# EAGLE design DectectorPhotodiode (EAGLE 5.11)
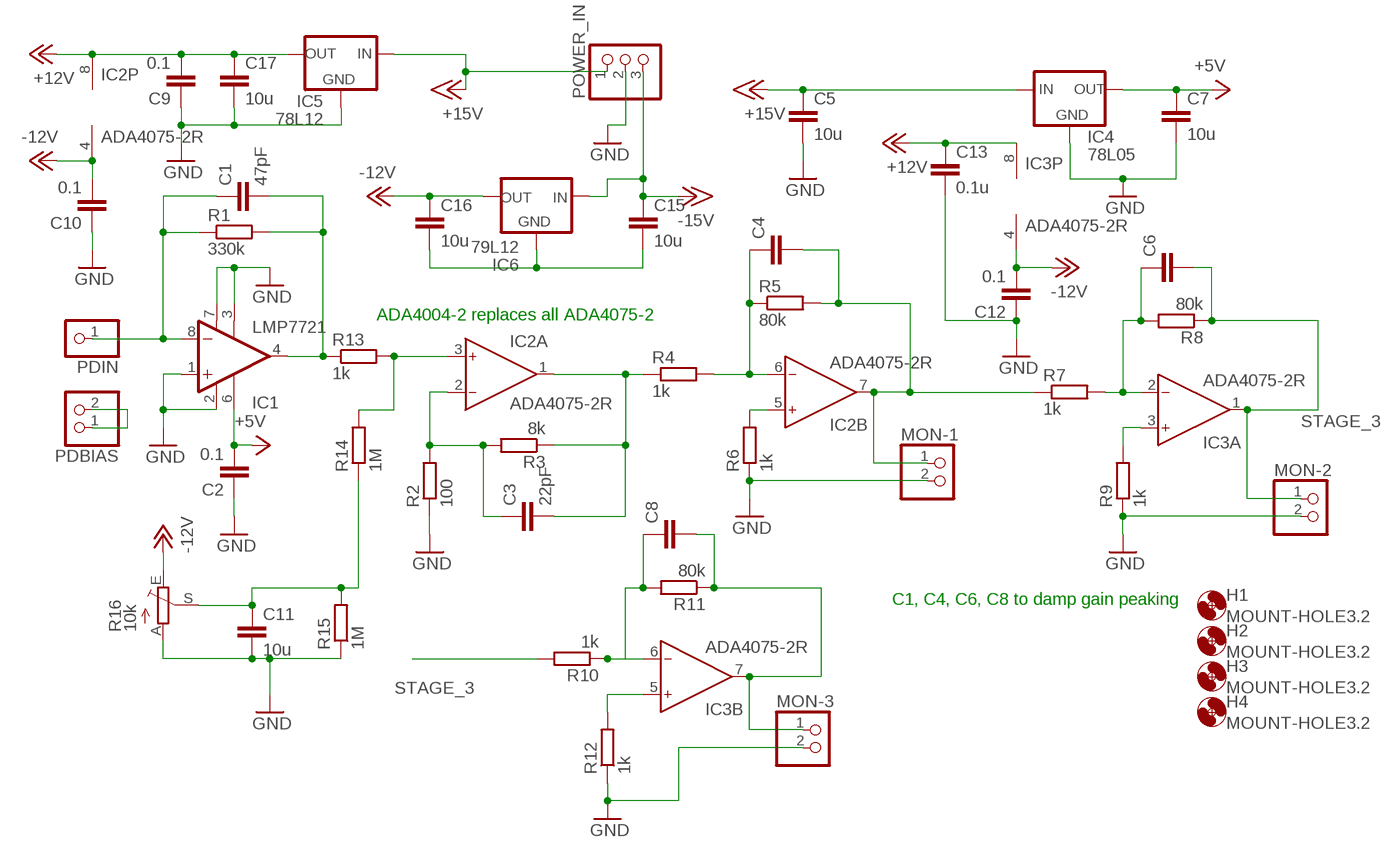
[diagram p0: schematic, sheet 1]

## Parts
C1  47pF  C-EUC0805  [C0805]
C2  0.1  C-EUC0805  [C0805]
C3  22pF  C-EUC0805  [C0805]
C4  C-EUC0805  [C0805]
C5  10u  C-EUC1206  [C1206]
C6  C-EUC0805  [C0805]
C7  10u  C-EUC1206  [C1206]
C8  C-EUC0805  [C0805]
C9  0.1  C-EUC0805  [C0805]
C10  0.1  C-EUC0805  [C0805]
C11  10u  C-EUC1206  [C1206]
C12  0.1  C-EUC0805  [C0805]
C13  0.1u  C-EUC0805  [C0805]
C15  10u  C-EUC1206  [C1206]
C16  10u  C-EUC1206  [C1206]
C17  10u  C-EUC1206  [C1206]
H1  MOUNT-HOLE3.2  [3,2]
H2  MOUNT-HOLE3.2  [3,2]
H3  MOUNT-HOLE3.2  [3,2]
H4  MOUNT-HOLE3.2  [3,2]
IC1  LMP7721  [SOIC8]
IC2  ADA4075-2R  [SO8]
IC3  ADA4075-2R  [SO8]
IC4  78L05  78LXX  [78LXX]
IC5  78L12  78LXX  [78LXX]
IC6  79L12  79LXX  [79LXX]
MON-1  PINHD-1X2  [1X02]
MON-2  PINHD-1X2  [1X02]
MON-3  PINHD-1X2  [1X02]
PDBIAS  PINHD-1X2  [1X02]
PDIN  PINHD-1X1  [1X01]
POWER_IN  PINHD-1X3  [1X03]
R1  330k  R-EU_R0805  [R0805]
R2  100  R-EU_R0805  [R0805]
R3  8k  R-EU_R0805  [R0805]
R4  1k  R-EU_R0805  [R0805]
R5  80k  R-EU_R0805  [R0805]
R6  1k  R-EU_R0805  [R0805]
R7  1k  R-EU_R0805  [R0805]
R8  80k  R-EU_R0805  [R0805]
R9  1k  R-EU_R0805  [R0805]
R10  1k  R-EU_R0805  [R0805]
R11  80k  R-EU_R0805  [R0805]
R12  1k  R-EU_R0805  [R0805]
R13  1k  R-EU_R0805  [R0805]
R14  1M  R-EU_R0805  [R0805]
R15  1M  R-EU_R0805  [R0805]
R16  10k  TRIM_EU-S63P  [S63P]

## Nets
+5V: C2.2 C7.1 IC1.6(V+) IC4.OUT
+12V: C9.2 C13.1 C17.1 IC2.8(P:V+) IC3.8(P:V+) IC5.OUT
+15V: C5.1 IC4.IN IC5.IN POWER_IN.1
-12V: C10.2 C12.2 C16.1 IC2.4(P:V-) IC3.4(P:V-) IC6.OUT R16.E
-15V: C15.1 IC6.IN POWER_IN.3
GND: C2.1 C5.2 C7.2 C9.1 C10.1 C11.2 C12.1 C13.2 C17.2 IC1.1(+IN) IC1.2(GRD) IC1.3(V-) IC1.7(GRD2) IC4.GND IC5.GND MON-1.2 MON-2.2 MON-3.2 POWER_IN.2 R2.1 R6.1 R9.1 R12.1 R15.1 R16.A
N$1: C1.1 IC1.8(-IN) PDIN.1 R1.1
N$2: C1.2 IC1.4(OUT) R1.2 R13.1
N$3: C3.1 IC2.2(A:IN-) R2.2 R3.2
N$4: C3.2 IC2.1(A:OUT) R3.1 R4.1
N$5: C4.1 IC2.6(B:IN-) R4.2 R5.1
N$6: IC2.5(B:IN+) R6.2
N$7: C4.2 IC2.7(B:OUT) MON-1.1 R5.2 R7.1
N$9: C6.1 IC3.2(A:IN-) R7.2 R8.2
N$10: C11.1 R14.1 R15.2 R16.S
N$11: PDBIAS.1 PDBIAS.2
N$12: IC3.3(A:IN+) R9.2
N$13: C8.1 IC3.6(B:IN-) R10.1 R11.2
N$14: C8.2 IC3.7(B:OUT) MON-3.1 R11.1
N$15: IC3.5(B:IN+) R12.2
N$16: IC2.3(A:IN+) R13.2 R14.2
N$22: C15.2 C16.2 IC6.GND
STAGE_3: C6.2 IC3.1(A:OUT) MON-2.1 R8.1 R10.2

## Notes on the sheet
- ADA4004-2 replaces all ADA4075-2
- C1, C4, C6, C8 to damp gain peaking

## Library data of the parts
C1-C13 C15-C17 = rcl:C-EU: CAPACITOR, European symbol
H1-H4 = holes:MOUNT-HOLE: MOUNTING HOLE with drill center marker
IC1 = custom_parts:LMP7721: 3fA input bias precision amplifier, National Semiconductor
IC2 IC3 = analog-devices:ADA4075-2: Ultralow Noise Amplifier at Lower Power Source: http://www.analog.com/static/imported-files/data_sheets/ADA4075-2.pdf; MPN: ADA4075-2ARZ; OC_FARNELL: 1701254; OC_NEWARK: 19P8164
IC4 IC5 = v-reg:78LXX: VOLTAGE REGULATOR
IC6 = v-reg:79LXX: VOLTAGE REGULATOR
MON-1-MON-3 PDBIAS = pinhead:PINHD-1X2: PIN HEADER
PDIN = pinhead:PINHD-1X1: PIN HEADER
POWER_IN = pinhead:PINHD-1X3: PIN HEADER
R1-R15 = rcl:R-EU_: RESISTOR, European symbol
R16 = pot:TRIM_EU-: POTENTIOMETER

## Board
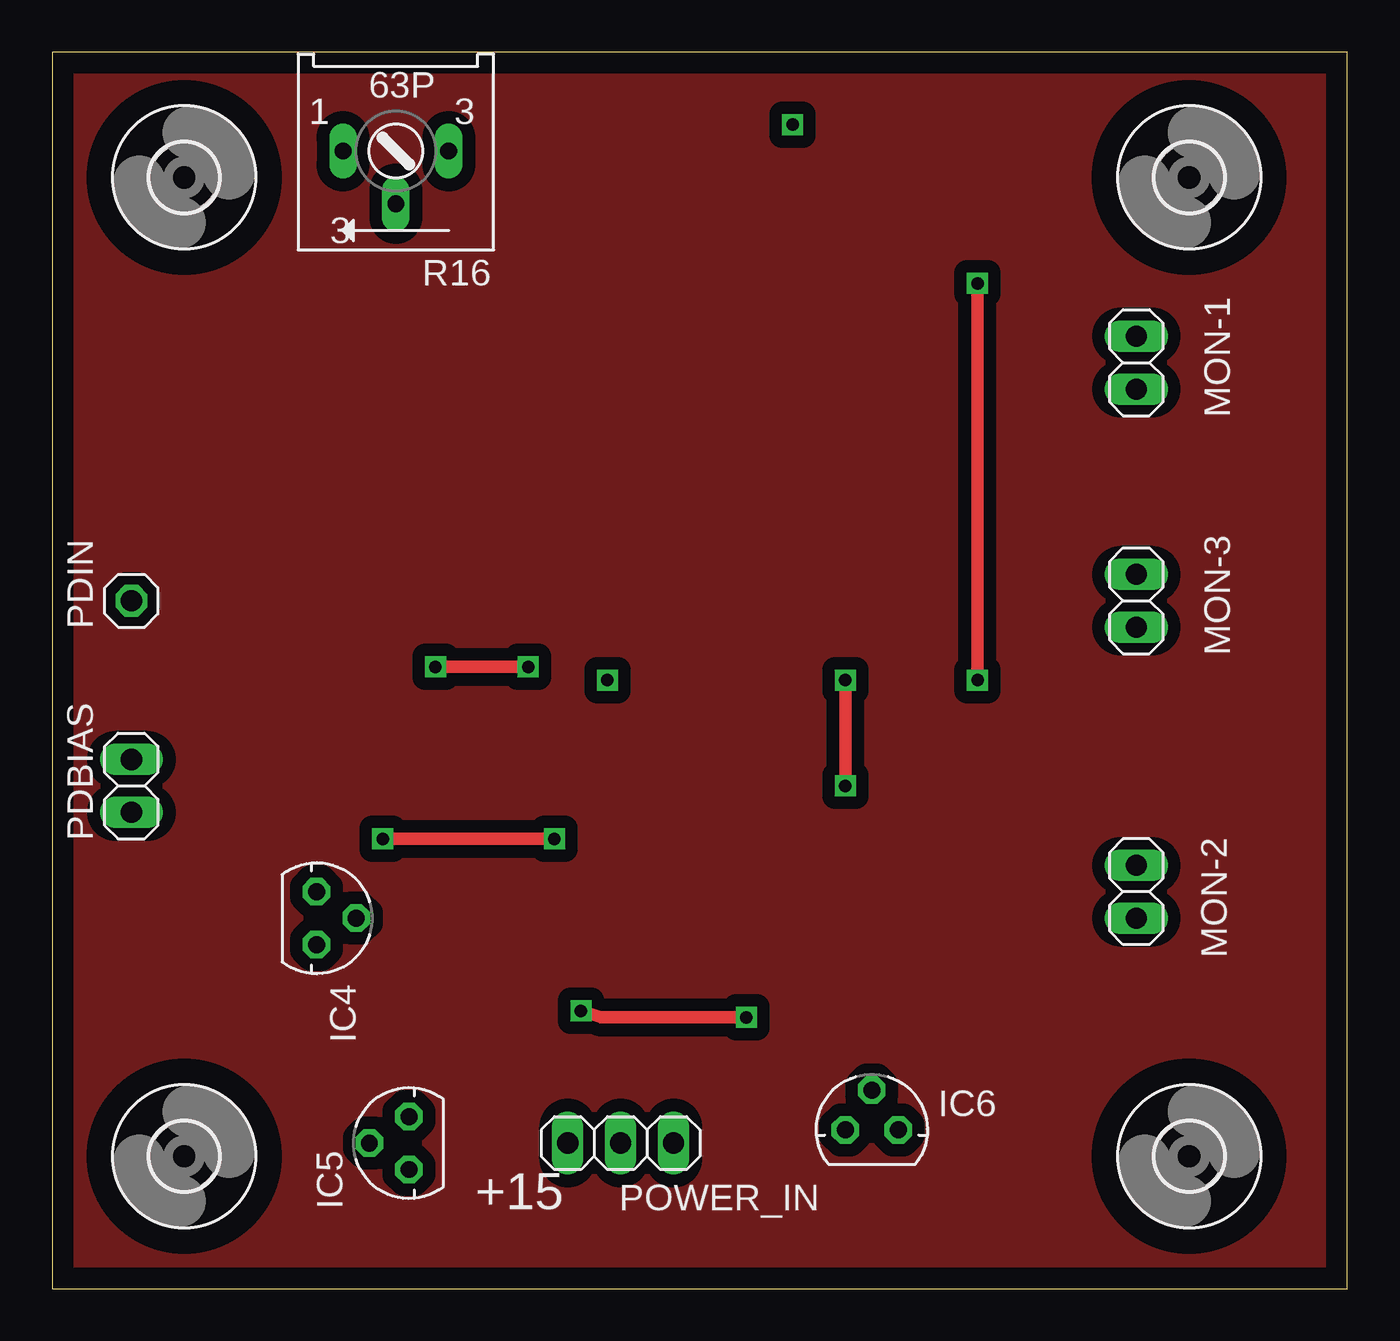
[diagram p1: board, top side]
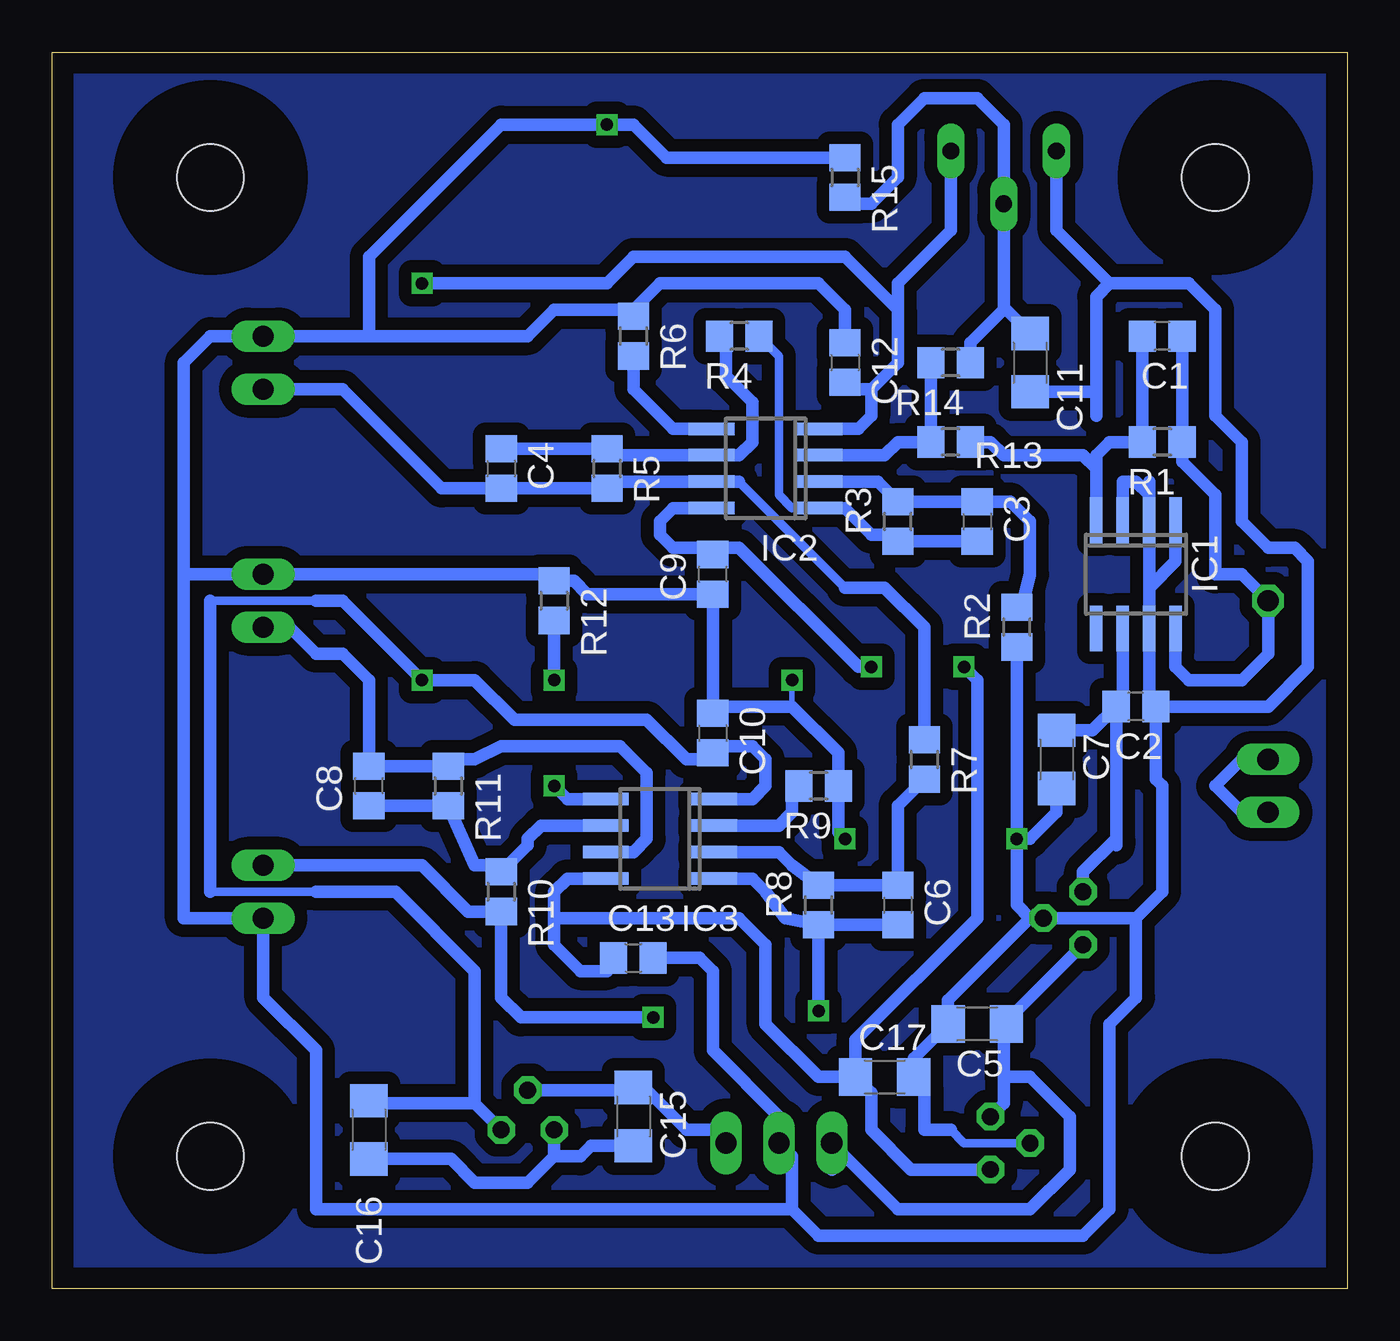
[diagram p2: board, bottom side, seen from below]

Size 62.21 x 59.36 mm. Coordinates in mm from the lower left corner, seen from the top.
Outline: 0,0 62.21,0 62.21,59.36 0,59.36 0,0
Copper layers (1*16): Top 0.035mm / dielectric 1.5mm / Bottom 0.035mm
Design rules "default": minimum track width 10mil, minimum drill 24mil, track to track 8mil, track to pad 8mil, pad to pad 8mil, via to via 8mil, smd to smd 8mil, copper to edge 40mil, drill to drill 8mil, minimum pad ring 10mil, minimum via ring 8mil, stop-mask expansion 4mil, vias tented up to drill 0mil, thermal gap 10mil

### Footprints (pad centres in the part's own frame; a part is rotated, then mirrored left to right if it is on the bottom)
C0805 = smd 1.3 x 1.5: 1 -0.95,0; 2 0.95,0
C1206 = smd 1.6 x 1.8: 1 -1.4,0; 2 1.4,0
3,2 = hole 3.2: 0,0
SOIC8 = smd 0.6 x 2.2: 1 -1.905,-2.6; 2 -0.635,-2.6; 3 0.635,-2.6; 4 1.905,-2.6; 5 1.905,2.6; 6 0.635,2.6; 7 -0.635,2.6; 8 -1.905,2.6
SO8 = smd 0.6 x 2.2: 1 -1.905,-2.6; 2 -0.635,-2.6; 3 0.635,-2.6; 4 1.905,-2.6; 5 1.905,2.6; 6 0.635,2.6; 7 -0.635,2.6; 8 -1.905,2.6
78LXX = drill 0.813 octagon: GND 0,1.905; IN 1.27,0; OUT -1.27,0
79LXX = drill 0.813 octagon: GND -1.27,0; IN 0,1.905; OUT 1.27,0
1X02 = drill 1.016 long: 1 -1.27,0; 2 1.27,0
1X01 = drill 1.016 octagon: 1 0,0
1X03 = drill 1.016 long: 1 -2.54,0; 2 0,0; 3 2.54,0
R0805 = smd 1.3 x 1.5: 1 -0.95,0; 2 0.95,0
S63P = drill 0.813 long: A 2.54,0; E -2.54,0; S 0,2.54

### Placement (x,y rotation side)
C1  8.89,45.72 180 bottom
C2  10.16,27.94 180 bottom
C3  17.78,36.83 270 bottom
C4  40.64,39.37 270 bottom
C5  17.78,12.7 180 bottom
C6  21.59,18.41 270 bottom
C7  13.97,25.4 270 bottom
C8  46.99,24.13 90 bottom
C9  30.48,34.29 90 bottom
C10  30.48,26.67 270 bottom
C11  15.24,44.45 270 bottom
C12  24.13,44.45 270 bottom
C13  34.29,15.88 0 bottom
C15  34.29,8.26 270 bottom
C16  46.99,7.62 270 bottom
C17  22.23,10.16 0 bottom
H1  6.35,6.35 0 top
H2  54.61,6.35 0 top
H3  54.61,53.34 0 top
H4  6.35,53.34 0 top
IC1  10.16,34.29 180 bottom
IC2  27.94,39.37 90 bottom
IC3  33.02,21.59 90 bottom
IC4  12.7,17.78 270 top
IC5  17.14,6.99 90 top
IC6  39.37,7.62 0 top
MON-1  52.07,44.45 90 top
MON-2  52.07,19.05 270 top
MON-3  52.07,33.02 90 top
PDBIAS  3.81,24.13 90 top
PDIN  3.81,33.02 90 top
POWER_IN  27.3,6.99 0 top
R1  8.89,40.64 180 bottom
R2  15.88,31.75 90 bottom
R3  21.59,36.83 90 bottom
R4  29.21,45.72 180 bottom
R5  35.56,39.37 270 bottom
R6  34.29,45.72 270 bottom
R7  20.32,25.4 270 bottom
R8  25.4,18.41 90 bottom
R9  25.4,24.13 180 bottom
R10  40.64,19.05 270 bottom
R11  43.18,24.13 270 bottom
R12  38.1,33.02 270 bottom
R13  19.05,40.64 180 bottom
R14  19.05,44.45 180 bottom
R15  24.13,53.34 270 bottom
R16  16.51,54.61 180 top

### Tracks (layer width: path | path; a pad name or v marks a point on that pad's centre or on a via)
+5V
  Bottom 0.61: 11.11,21.59 11.11,21.27 | 11.11,21.59 C2.2 | IC4.OUT 12.7,20 11.11,21.59 | IC1.6 10.79,28.25 C2.2 | C7.1 12.25,26.8 C2.2
+12V  (via drill 0.6)
  Top 0.61: v18.41,29.84 v22.86,29.84
  Bottom 0.61: IC2.8 32.38,37.47 33.02,36.83 33.02,36.2 32.38,35.56 30.8,35.56 C9.2 30.16,35.56 29.21,35.56 23.5,29.84 v22.86,29.84 | IC3.8 37.46,19.68 38.1,19.05 38.1,17.78 | 38.1,17.78 38.1,16.51 36.83,15.24 35.56,15.24 35.56,15.55 C13.1 | C17.1 22.86,9.39 22.86,7.62 20.96,5.71 IC5.OUT | C17.1 25.4,10.16 27.94,12.7 27.94,16.51 29.21,17.78 38.1,17.78 | C17.1 23.62,11.94 17.78,17.78 17.78,29.21 v18.41,29.84
+15V
  Bottom 0.61: 24.77,5.71 POWER_IN.1 21.59,3.81 15.24,3.81 13.34,5.71 13.34,8.26 15.24,10.16 16.51,10.16 | IC4.IN 16.38,12.83 C5.1 16.51,12.57 16.51,10.16 | 16.51,10.16 16.51,8.89 IC5.IN
-12V  (via drill 0.6)
  Top 0.61: v44.45,29.21 v44.45,48.26
  Bottom 0.406: 49.53,19.05 54.61,19.05 | 54.61,33.02 49.53,33.02
  Bottom 0.61: 22.86,43.18 21.59,44.45 21.59,46.99 | 21.59,46.99 24.13,49.53 34.29,49.53 35.56,48.26 v44.45,48.26 | 21.59,46.99 21.59,48.26 19.05,50.8 R16.E | IC2.4 23.5,41.27 22.86,41.91 22.86,43.18 | 22.86,43.18 23.81,43.18 C12.2 | IC6.OUT 41.91,8.89 | 41.91,8.89 46.86,8.89 C16.1 | IC3.4 28.57,23.5 27.94,24.13 27.94,25.4 28.57,26.04 30.16,26.04 C10.2 30.8,25.4 31.75,25.4 33.65,27.3 40,27.3 41.91,29.21 v44.45,29.21 48.26,33.02 49.53,33.02 | 41.91,8.89 41.91,15.24 45.72,19.05 49.53,19.05 | 54.61,19.05 54.61,33.02
-15V
  Bottom 0.61: IC6.IN 34.42,9.53 C15.1 33.78,9.65 31.75,7.62 30.48,7.62 POWER_IN.3
GND  (via drill 0.6)
  Top 0.61: v15.88,21.59 v24.13,21.59
  Bottom 0.254: 26.67,27.94 v26.67,29.21
  Bottom 0.406: IC5.GND 18.41,6.99 19.05,7.62
  Bottom 0.61: IC1.1 8.26,34.92 9.53,33.66 | 9.53,33.66 IC1.7 9.53,28.25 C2.1 | C2.1 9.21,24.45 8.89,24.13 8.89,19.05 10.16,17.78 | C2.1 3.81,27.94 1.9,29.84 1.9,34.92 2.54,35.56 3.81,35.56 5.08,36.83 5.08,40.64 6.35,41.91 6.35,46.99 7.62,48.26 11.43,48.26 | 9.53,38.1 9.53,38.73 | 9.53,38.1 IC1.2 9.53,33.66 | IC1.3 10.79,38.73 10.16,38.73 9.53,38.1 | v24.13,21.59 24.45,21.91 R9.1 24.45,25.72 26.67,27.94 30.16,27.94 C10.1 C9.1 36.51,33.34 37.14,33.97 R12.1 38.42,34.29 MON-3.2 55.88,34.29 | v15.88,21.59 15.88,18.41 15.24,17.78 | 15.24,17.78 IC4.GND 10.16,17.78 | 46.99,45.72 MON-1.2 54.61,45.72 55.88,44.45 55.88,34.29 | 46.99,45.72 39.37,45.72 38.1,46.99 34.61,46.99 R6.1 34.29,46.99 33.02,48.26 25.4,48.26 24.13,46.99 C12.1 | v15.88,21.59 R2.1 | 11.43,48.26 12.07,47.62 12.07,43.18 | 12.07,43.18 12.07,41.91 | R16.A 13.97,50.8 11.43,48.26 | C11.2 12.2,43.05 12.07,43.18 | v15.88,21.59 15.24,21.59 13.97,22.86 C7.2 | R15.1 32.7,54.29 34.29,55.88 v35.56,55.88 40.64,55.88 46.99,49.53 46.99,45.72 | C13.2 31.11,15.88 30.48,15.24 30.48,11.43 27.3,8.26 POWER_IN.2 26.67,6.35 26.67,3.81 | 15.24,17.78 19.18,13.84 C5.2 20.82,11.05 C17.2 20.32,9.65 20.32,7.62 19.05,7.62 | 10.16,17.78 10.16,13.97 11.43,12.7 11.43,3.81 12.7,2.54 25.4,2.54 26.67,3.81 | 55.88,34.29 55.88,17.78 MON-2.2 52.07,13.97 49.53,11.43 49.53,3.81 26.67,3.81
N$1
  Bottom 0.61: IC1.8 8.26,29.84 7.62,29.21 5.08,29.21 3.81,30.48 PDIN.1 5.08,34.29 6.35,34.29 6.35,38.1 7.94,39.69 R1.1 C1.1
N$2
  Bottom 0.61: C1.2 R1.2 11.43,40.64 12.07,40.01 12.07,39.37 | IC1.4 12.07,39.37 | R13.1 17.14,40.64 16.51,40.01 12.7,40.01 12.07,39.37
N$3
  Bottom 0.61: IC2.2 22.55,38.73 R3.2 C3.1 16.19,37.78 15.24,36.83 15.24,34.29 15.55,33.02 R2.2
N$4
  Bottom 0.406: IC2.1 26.67,37.47 27.3,38.1 27.3,44.77 R4.1
  Bottom 0.61: IC2.1 24.13,37.47 22.86,36.2 21.91,36.2 R3.1 C3.2 | R4.1 27.94,45.4
N$5
  Bottom 0.61: C4.1 R5.1 35.24,40.01 IC2.6 29.21,40.01 28.57,40.64 28.57,42.55 29.84,43.81 29.84,45.41 R4.2
N$6
  Bottom 0.61: IC2.5 32.38,41.27 34.29,43.18 R6.2
N$7
  Bottom 0.406: 24.13,33.66 29.21,38.73
  Bottom 0.61: 29.21,38.73 IC2.7 35.24,38.73 R5.2 C4.2 43.5,38.42 48.26,43.18 MON-1.1 | 24.13,33.66 22.23,33.66 20.32,31.75 R7.1
N$8
  pour Bottom (isolate 0.61): 0,0 0,59.05 62.23,59.05 62.23,58.42 62.23,0
N$9
  Bottom 0.61: IC3.2 27.3,20.95 26.67,20.32 R8.2 C6.1 21.59,23.18 R7.2 20.32,24.13
N$10
  Bottom 0.61: 16.45,47.05 C11.1 | 16.45,47.05 16.51,47.12 R16.S 16.51,55.88 17.78,57.15 20.32,57.15 21.59,55.88 21.59,53.34 22.86,52.07 23.81,52.07 R15.2 | R14.1 18.1,45.4 16.45,47.05
N$11
  Bottom 0.61: PDBIAS.2 5.08,25.4 6.35,24.13 5.08,22.86 PDBIAS.1
N$12
  Bottom 0.61: IC3.3 27.3,22.23 26.67,22.86 26.67,23.81 R9.2
N$13
  Bottom 0.61: C8.1 R11.2 41.91,20.32 40.96,20.32 R10.1 39.37,21.27 39.37,21.59 38.73,22.23 IC3.6
N$14
  Bottom 0.61: MON-3.1 50.8,31.75 49.53,30.48 48.26,30.48 46.99,29.21 C8.2 R11.1 42.86,25.4 41.91,25.4 40.64,26.04 34.92,26.04 33.65,24.77 33.65,21.59 34.29,20.95 IC3.7
N$15  (via drill 0.6)
  Top 0.61: v38.1,24.13 v38.1,29.21
  Bottom 0.61: IC3.5 37.46,23.5 v38.1,24.13 | v38.1,29.21 R12.2
N$16
  Bottom 0.61: R14.2 R13.2 21.59,40.64 22.23,40.01 IC2.3
N$17
  pour Top (isolate 0.61): 0,0 0,59.05 62.23,59.05 62.23,58.42 62.23,0
N$22
  Bottom 0.61: C16.2 43.05,6.22 41.91,5.08 39.37,5.08 38.1,6.35 | 38.1,6.35 IC6.GND | C15.2 36.32,6.86 36.83,6.35 38.1,6.35
STAGE_3  (via drill 0.6)
  Top 0.61: v25.4,13.34 26.36,13.02 v33.34,13.02
  Bottom 0.61: C6.2 R8.1 | IC3.1 28.57,19.68 27.94,19.05 26.99,17.78 R8.1 | R8.1 v25.4,13.34 | v33.34,13.02 39.69,13.02 40.64,13.97 R10.2 42.23,18.1 44.45,20.32 MON-2.1

### Text on the board
tPlace: +15